# EAGLE design CAN (EAGLE 8.2.1)
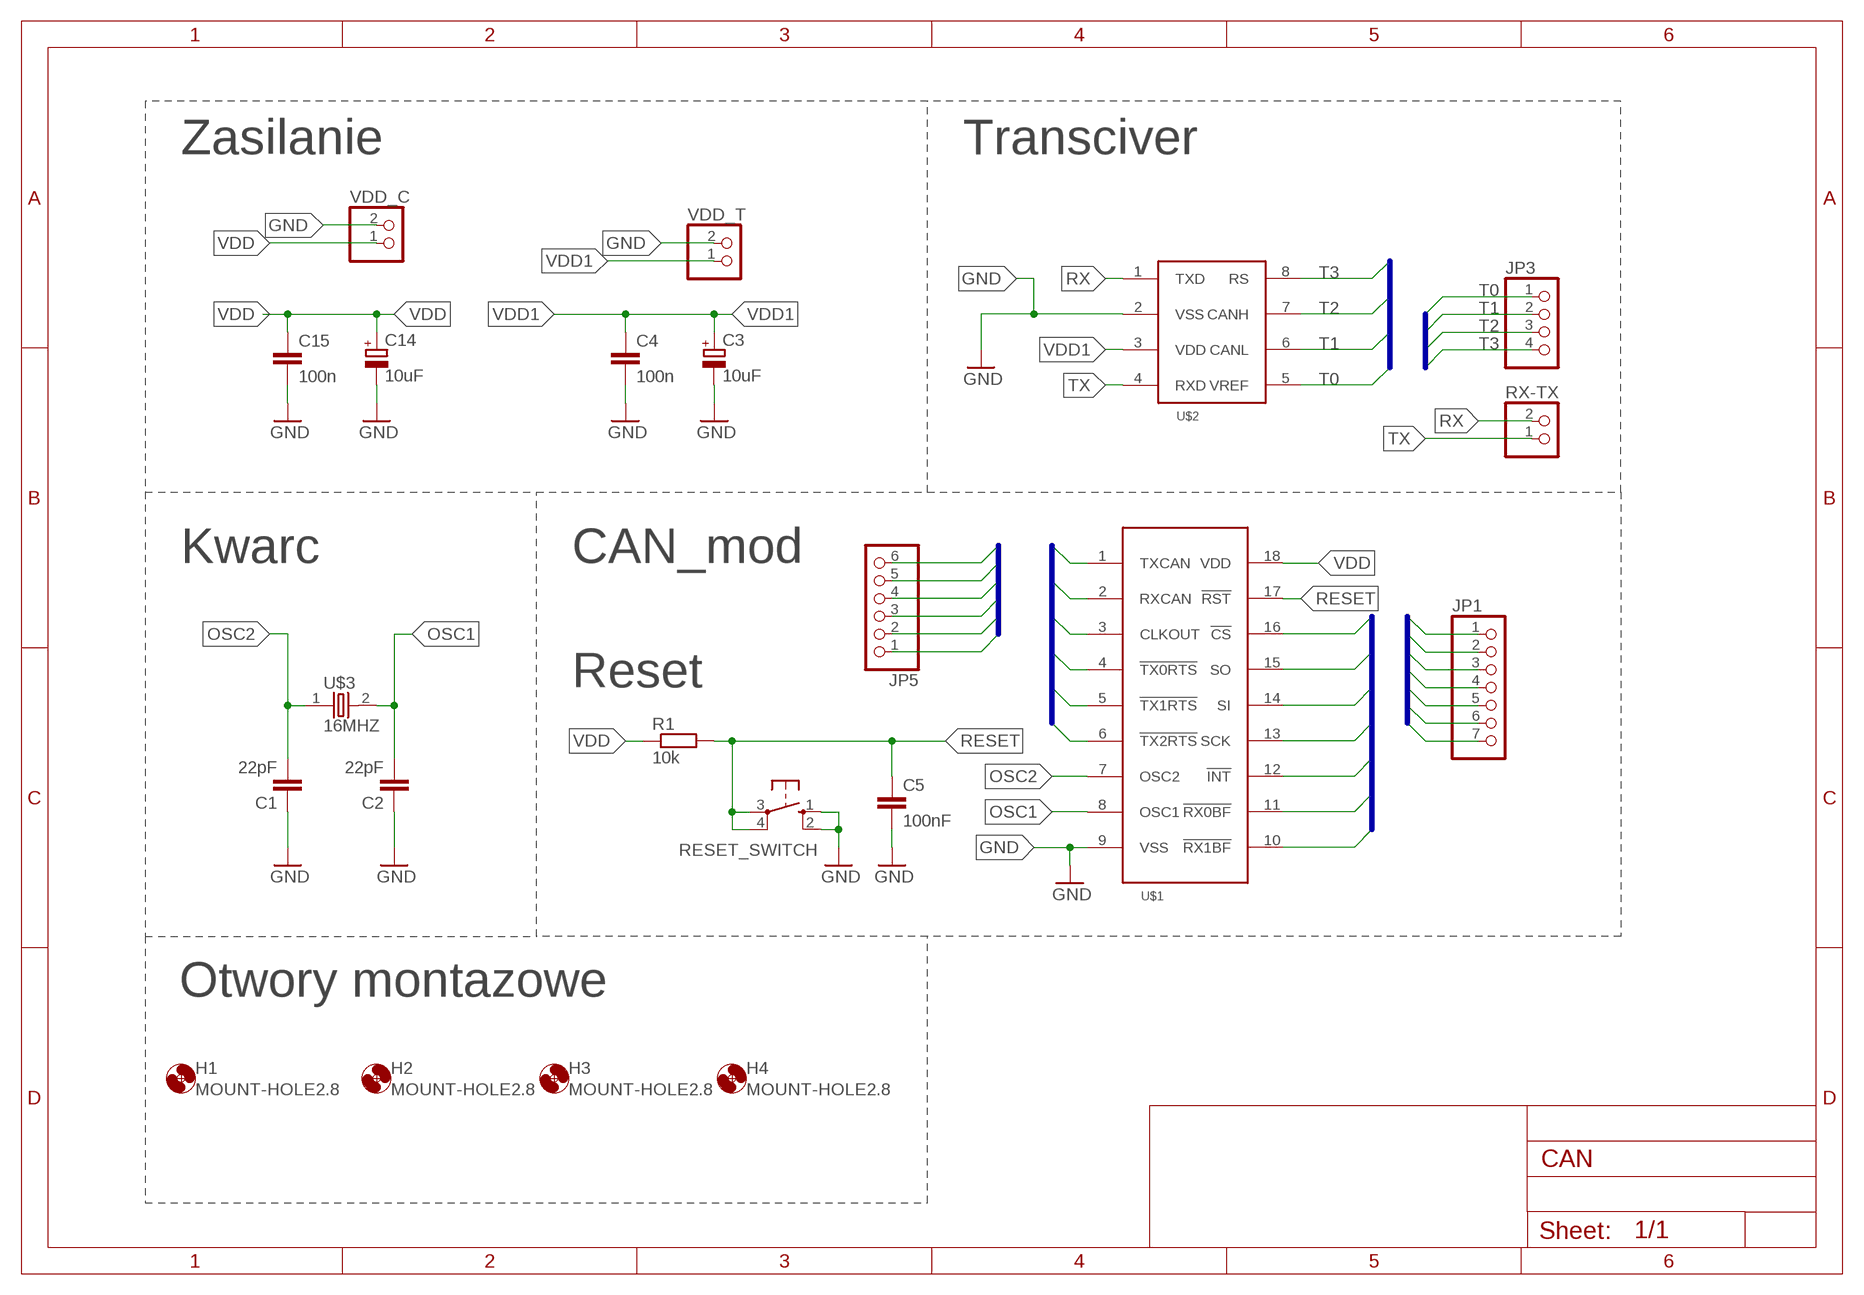
[diagram p0: schematic, sheet 1]

## Parts
C1  22pF  C-EUC3216  [C3216]
C2  22pF  C-EUC3216  [C3216]
C3  10uF  CPOL-EUA/3216-18W  [A/3216-18W]
C4  100n  C-EUC1206K  [C1206K]
C5  100nF  C-EUC1206K  [C1206K]
C14  10uF  CPOL-EUA/3216-18W  [A/3216-18W]
C15  100n  C-EUC1206K  [C1206K]
H1  MOUNT-HOLE2.8  [2,8]
H2  MOUNT-HOLE2.8  [2,8]
H3  MOUNT-HOLE2.8  [2,8]
H4  MOUNT-HOLE2.8  [2,8]
JP1  PINHD-1X7MAT_LCD  [1X07]
JP3  PINHD-1X4  [1X04]
JP5  PINHD-1X6MAT6  [1X06]
R1  10k  R-EU_R3216  [R3216]
RESET_SWITCH  10-XX  [B3F-10XX]
RX-TX  PINHD-1X2  [1X02]
U$1  MCP2515  [MCP2515]
U$2  MCP2551  [MCP2551]
U$3  16MHZ  [HC49SM]
VDD_C  PINHD-1X2  [1X02]
VDD_T  PINHD-1X2  [1X02]

## Nets
CAN0: JP1.1 U$1.10(!RX1BF)
CAN1: JP1.2 U$1.11(!RX0BF)
CAN2: JP1.3 U$1.12(!INT)
CAN3: JP1.4 U$1.13(SCK)
CAN4: JP1.5 U$1.14(SI)
CAN5: JP1.6 U$1.15(SO)
CAN6: JP1.7 U$1.16(!CS)
CANL0: JP5.1 U$1.6(!TX2RTS)
CANL1: JP5.2 U$1.5(!TX1RTS)
CANL2: JP5.3 U$1.4(!TX0RTS)
CANL3: JP5.4 U$1.3(CLKOUT)
CANL4: JP5.5 U$1.2(RXCAN)
CANL5: JP5.6 U$1.1(TXCAN)
GND: C1.1 C2.1 C3.- C4.2 C5.2 C14.- C15.2 RESET_SWITCH.1(S) RESET_SWITCH.2(S1) U$1.9(VSS) U$2.2(VSS) VDD_C.2 VDD_T.2
OSC1: C2.2 U$1.8(OSC1) U$3.2
OSC2: C1.2 U$1.7(OSC2) U$3.1
RESET: C5.1 R1.2 RESET_SWITCH.3(P) RESET_SWITCH.4(P1) U$1.17(!RST)
RX: RX-TX.2 U$2.1(TXD)
T0: JP3.1 U$2.5(VREF)
T1: JP3.2 U$2.6(CANL)
T2: JP3.3 U$2.7(CANH)
T3: JP3.4 U$2.8(RS)
TX: RX-TX.1 U$2.4(RXD)
VDD: C14.+ C15.1 R1.1 U$1.18(VDD) VDD_C.1
VDD1: C3.+ C4.1 U$2.3(VDD) VDD_T.1

## Buses
CAN[0..6]
CANL[0..5]
T[0..3]

## Notes on the sheet
- Zasilanie | Transciver
- Kwarc | CAN_mod
- Reset
- Otwory montazowe

## Library data of the parts
C1 C2 C4 C5 C15 = rcl:C-EU: CAPACITOR, European symbol
C3 C14 = rcl:CPOL-EU: POLARIZED CAPACITOR, European symbol
H1-H4 = holes:MOUNT-HOLE: MOUNTING HOLE with drill center marker
JP1 = pinheadMateusz_popr:PINHD-1X7: PIN HEADER
JP3 = pinheadMateusz_popr:PINHD-1X4: PIN HEADER
JP5 = pinheadMateusz_popr:PINHD-1X6: PIN HEADER
R1 = rcl:R-EU_: RESISTOR, European symbol
RESET_SWITCH = switch-omron:10-XX: OMRON SWITCH; MPN: B3F-1000; OC_FARNELL: 176432; OC_NEWARK: 36M3542
RX-TX VDD_C VDD_T = pinheadMateusz_popr:PINHD-1X2: PIN HEADER
U$1 = Inzynierka:MCP2515
U$2 = Inzynierka:MCP2551
U$3 = Inzynierka:16MHZ

## Board
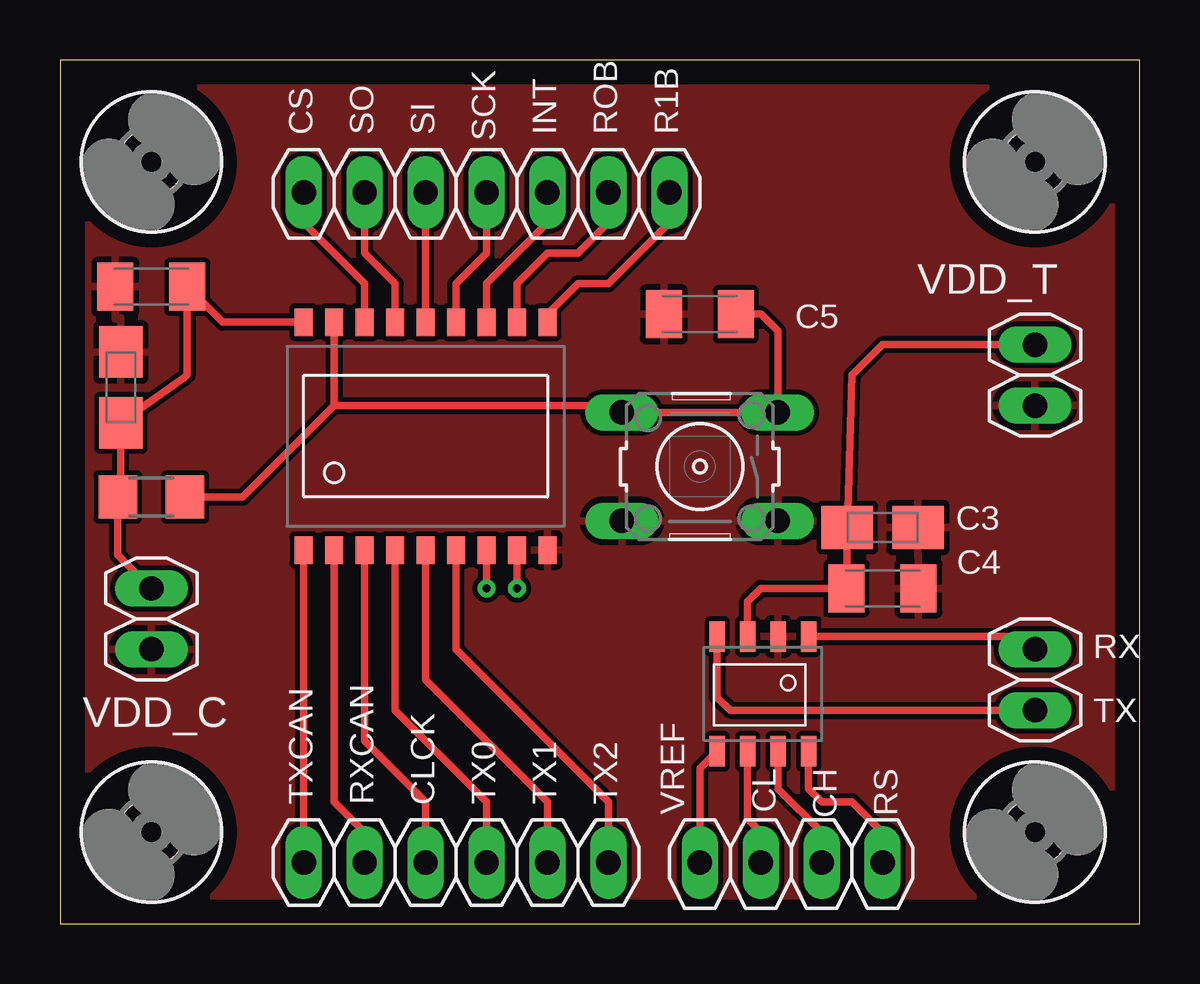
[diagram p1: board, top side]
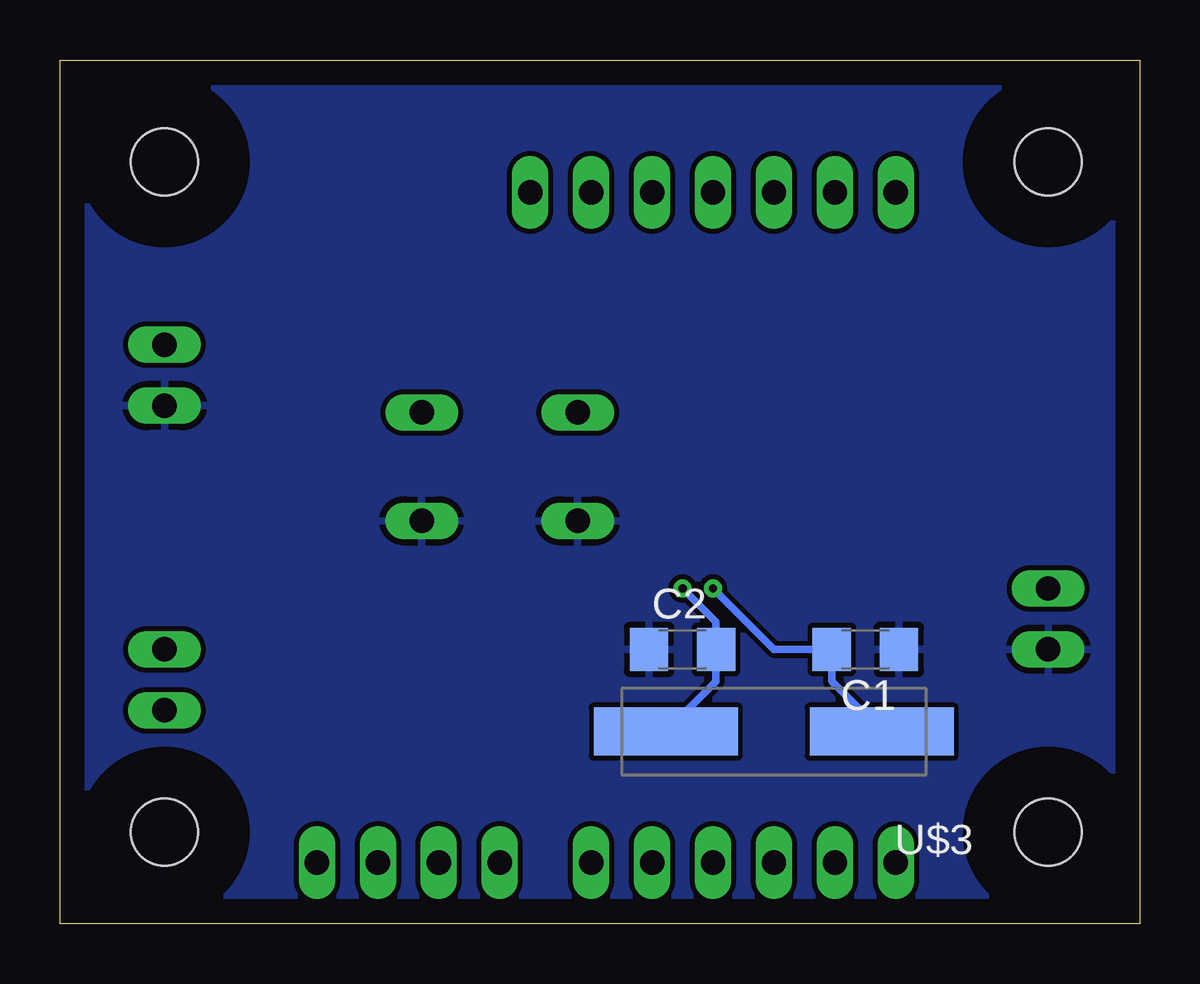
[diagram p2: board, bottom side, seen from below]

Size 45 x 36 mm. Coordinates in mm from the lower left corner, seen from the top.
Outline: 0,0 45,0 45,36 0,36 0,0
Copper layers (1*16): Top 0.035mm / dielectric 1.5mm / Bottom 0.035mm
Design rules "default *": minimum track width 8mil, minimum drill 0.35mm, track to track 8mil, track to pad 8mil, pad to pad 8mil, via to via 8mil, smd to smd 8mil, copper to edge 40mil, drill to drill 8mil, minimum pad ring 10mil, minimum via ring 8mil, stop-mask expansion 4mil, vias tented up to drill 0mil, thermal gap 10mil

### Footprints (pad centres in the part's own frame; a part is rotated, then mirrored left to right if it is on the bottom)
C3216 = smd 1.6 x 1.8: 1 -1.4,0; 2 1.4,0
A/3216-18W = smd 2.15 x 1.8: + 1.475,0; - -1.475,0
C1206K = smd 1.5 x 2: 1 -1.5,0; 2 1.5,0
2,8 = hole 2.8: 0,0
1X07 = drill 1.016 long: 1 -7.62,0; 2 -5.08,0; 3 -2.54,0; 4 0,0; 5 2.54,0; 6 5.08,0; 7 7.62,0
1X04 = drill 1.016 long: 1 -3.81,0; 2 -1.27,0; 3 1.27,0; 4 3.81,0
1X06 = drill 1.016 long: 1 -6.35,0; 2 -3.81,0; 3 -1.27,0; 4 1.27,0; 5 3.81,0; 6 6.35,0
R3216 = smd 1.6 x 1.8: 1 -1.4,0; 2 1.4,0
B3F-10XX = drill 1.016 long: 1 -3.251,2.261; 2 3.251,2.261; 3 -3.251,-2.261; 4 3.251,-2.261
1X02 = drill 1.016 long: 1 -1.27,0; 2 1.27,0
MCP2515 = smd 0.762 x 1.143: 1 -5.08,-4.75; 2 -3.81,-4.75; 3 -2.54,-4.75; 4 -1.27,-4.75; 5 0,-4.75; 6 1.27,-4.75; 7 2.54,-4.75; 8 3.81,-4.75; 9 5.08,-4.75; 10 5.08,4.75; 11 3.81,4.75; 12 2.54,4.75; 13 1.27,4.75; 14 0,4.75; 15 -1.27,4.75; 16 -2.54,4.75; 17 -3.81,4.75; 18 -5.08,4.75
MCP2551 = smd 1.27 x 0.635: 1 4.345,0.545; 2 4.345,1.815; 3 4.345,3.085; 4 4.345,4.355; 5 -0.435,4.355; 6 -0.435,3.085; 7 -0.435,1.815; 8 -0.435,0.545
HC49SM = smd 6 x 2: 1 -4.5,0; 2 4.5,0

### Placement (x,y rotation side)
C1  11.43,11.43 180 bottom
C2  19.05,11.43 0 bottom
C3  34.29,16.51 180 top
C4  34.29,13.97 0 top
C5  26.67,25.4 180 top
C14  2.54,22.35 270 top
C15  3.81,26.54 180 top
H1  3.81,3.81 0 top
H2  40.64,3.81 0 top
H3  3.81,31.75 0 top
H4  40.64,31.75 0 top
JP1  17.78,30.48 180 top
JP3  30.48,2.54 0 top
JP5  16.51,2.54 180 top
R1  3.81,17.78 0 top
RESET_SWITCH  26.67,19.05 180 top
RX-TX  40.64,10.16 90 top
U$1  15.24,20.32 0 top
U$2  31.75,7.62 90 top
U$3  15.24,8 180 bottom
VDD_C  3.81,12.7 270 top
VDD_T  40.64,22.86 270 top

### Tracks (layer width: path | path; a pad name or v marks a point on that pad's centre or on a via)
CAN0
  Top 0.305: U$1.10 20.32,25.4 21.59,26.67 22.86,26.67 25.4,29.21 JP1.1
CAN1
  Top 0.305: U$1.11 19.05,26.67 20.32,27.94 21.59,27.94 22.86,29.21 JP1.2
CAN2
  Top 0.305: U$1.12 17.78,26.67 20.32,29.21 JP1.3
CAN3
  Top 0.305: U$1.13 16.51,26.67 17.78,27.94 JP1.4
CAN4
  Top 0.305: U$1.14 JP1.5
CAN5
  Top 0.305: U$1.15 13.97,26.67 12.7,27.94 JP1.6
CAN6
  Top 0.305: U$1.16 12.7,26.67 10.16,29.21 JP1.7
CANL0
  Top 0.305: JP5.1 22.86,5.08 16.51,11.43 U$1.6
CANL1
  Top 0.305: JP5.2 20.32,5.08 15.24,10.16 U$1.5
CANL2
  Top 0.305: JP5.3 17.78,5.08 15.24,7.62 13.97,8.89 U$1.4
CANL3
  Top 0.305: JP5.4 15.24,5.08 12.7,7.62 U$1.3
CANL4
  Top 0.305: JP5.5 12.7,3.81 11.43,5.08 U$1.2
CANL5
  Top 0.305: JP5.6 U$1.1
GND
  pour Top: -2.54,-2.54 -2.54,39.37 48.26,39.37 48.26,-2.54
  pour Bottom: -2.54,-2.54 -2.54,39.37 48.26,39.37 48.26,-2.54
OSC1  (via drill 0.35)
  Top 0.305: v19.05,13.97 U$1.8
  Bottom 0.305: v19.05,13.97 17.65,12.57 C2.2 17.65,10.09 U$3.2
OSC2  (via drill 0.35)
  Top 0.305: v17.78,13.97 U$1.7
  Bottom 0.305: v17.78,13.97 15.24,11.43 C1.2 12.83,10.09 U$3.1
RESET
  Top 0.305: R1.2 7.62,17.78 11.43,21.59 | U$1.17 11.43,21.59 | 11.43,21.59 23.14,21.59 RESET_SWITCH.4 RESET_SWITCH.3 29.92,24.69 29.21,25.4 C5.1
RX
  Top 0.305: U$2.1 40.1,11.96 RX-TX.2
T0
  Top 0.305: JP3.1 26.67,6.46 U$2.5
T1
  Top 0.305: U$2.6 28.66,4.36 29.21,3.81 JP3.2
T2
  Top 0.305: U$2.7 29.93,5.62 31.75,3.81 JP3.3
T3
  Top 0.305: U$2.8 31.2,5.62 31.75,5.08 33.02,5.08 34.29,3.81 JP3.4
TX
  Top 0.305: U$2.4 27.39,9.44 27.94,8.89 RX-TX.1
VDD
  Top 0.305: VDD_C.1 2.41,15.37 R1.1 2.54,17.91 C14.+ 5.18,22.76 5.31,22.89 C15.1 6.78,25.07 U$1.18
VDD1
  Top 0.305: VDD_T.1 34.29,24.13 33.02,22.86 C3.+ C4.1 29.21,13.97 28.66,13.43 U$2.3

### Text on the board
tNames: CS | SO | SI | SCK | INT | ROB | R1B | RX | VREF | TX | CL | CH | RS | TXCAN | RXCAN | CLCK | TX0 | TX1 | TX2